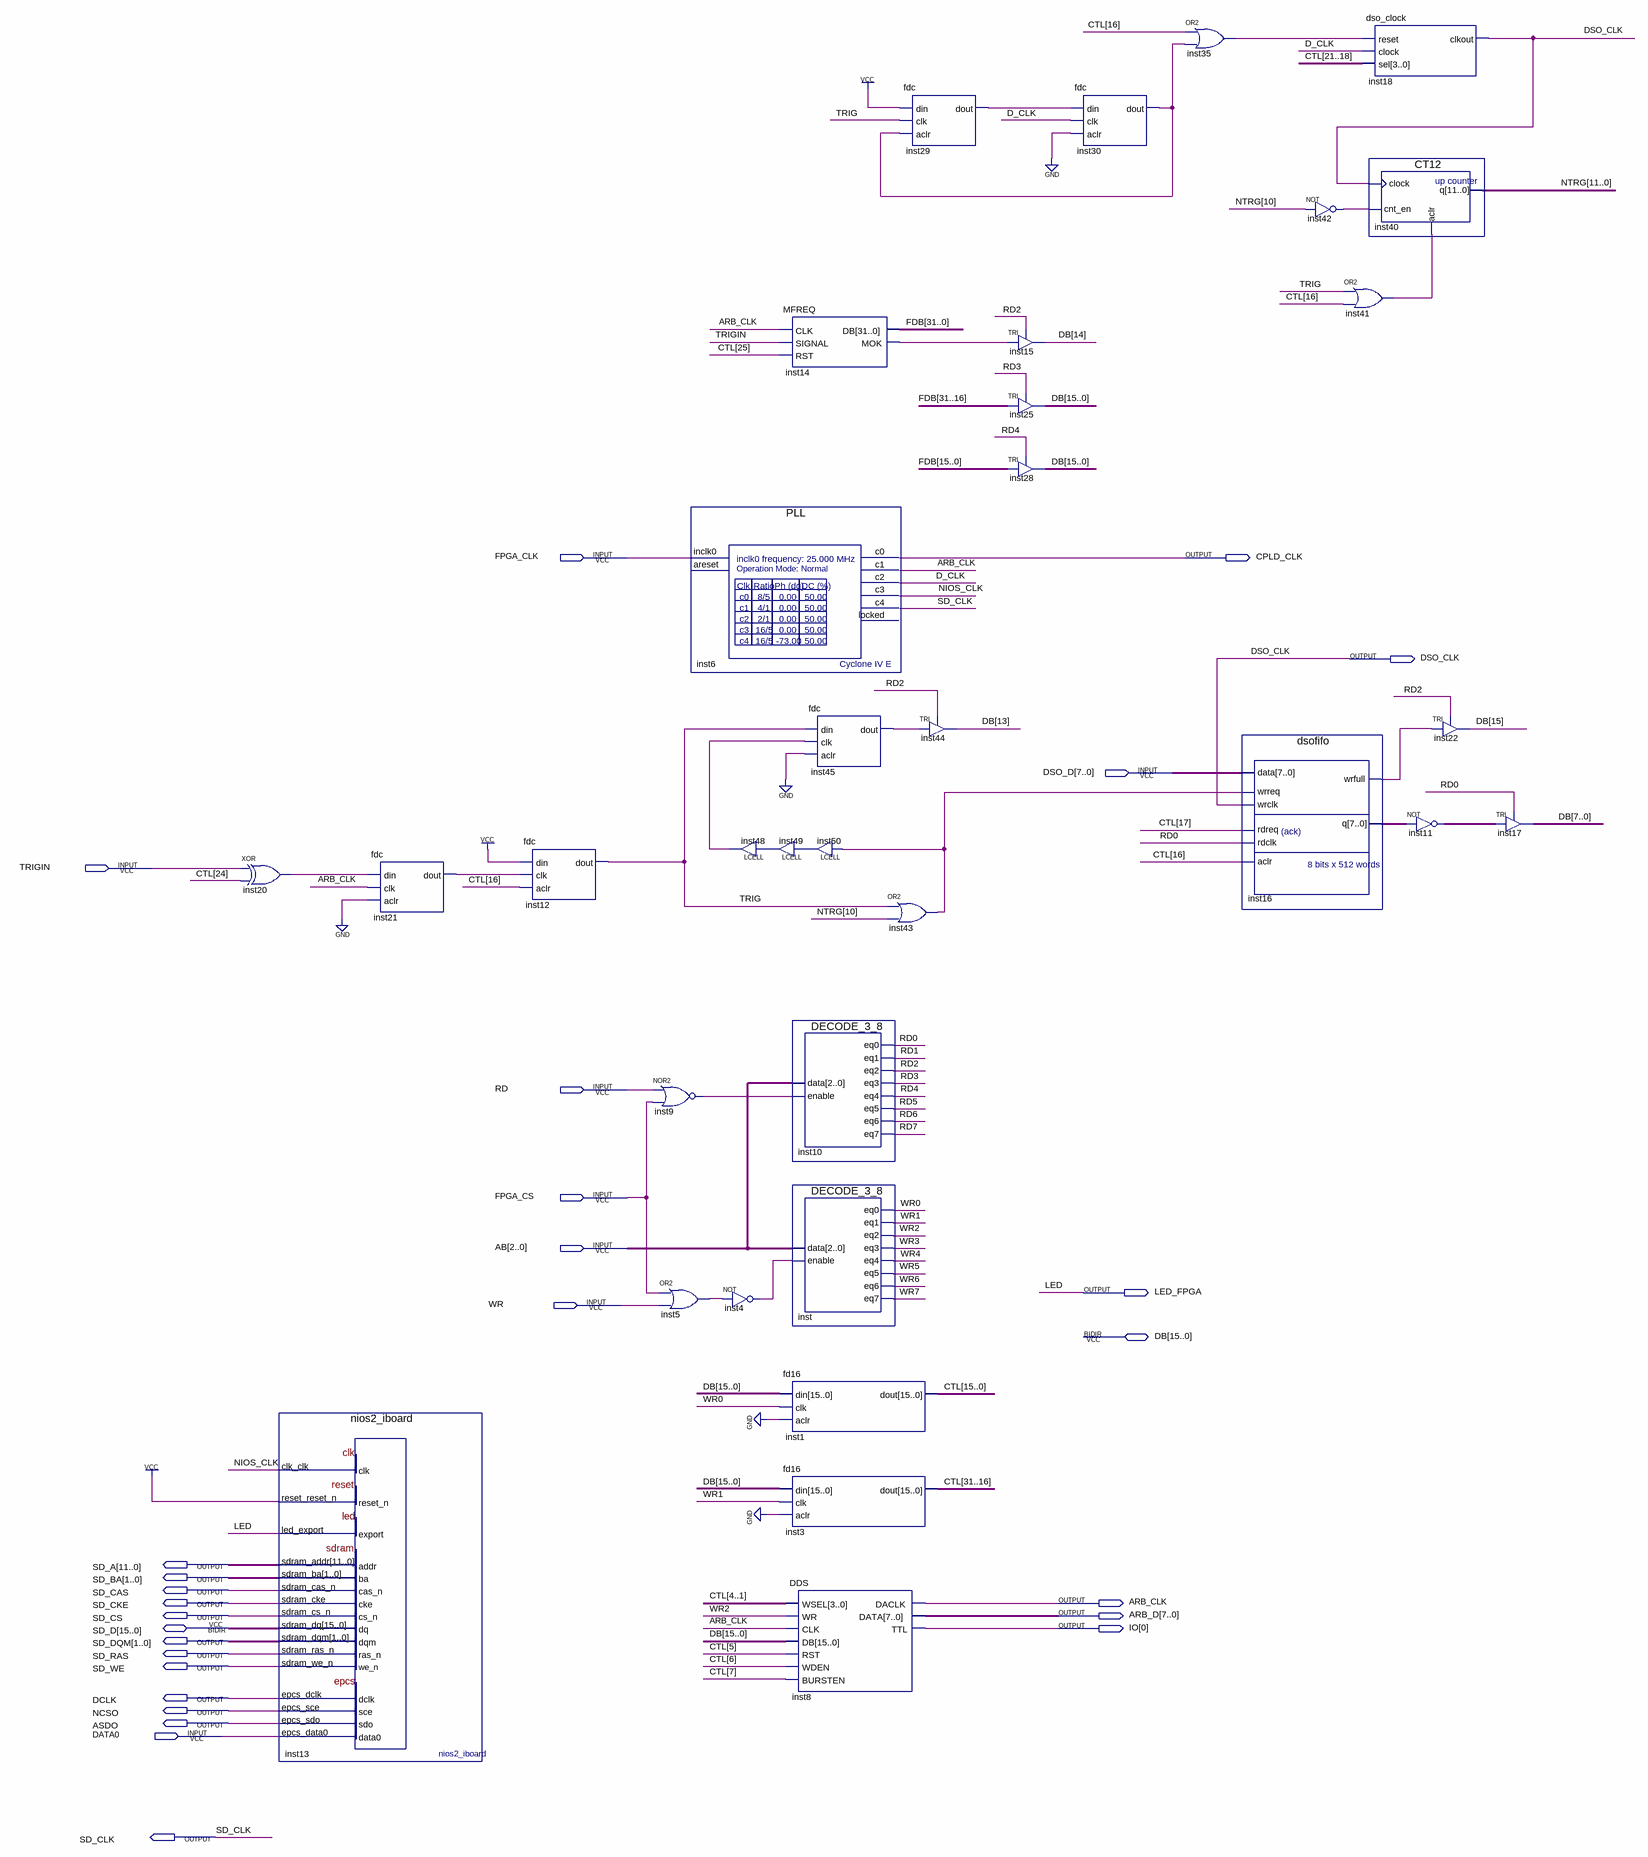
[diagram p0: schematic sheet]
// Quartus schematic DSO.bdf as structural Verilog: 34 symbols, 28 pins
module DSO (
  input  FPGA_CLK,
  input  [7:0] DSO_D,
  input  TRIGIN,
  input  RD,
  input  FPGA_CS,
  input  [2:0] AB,
  input  WR,
  input  DATA0,
  inout  [15:0] DB,
  inout  [15:0] SD_D,
  output CPLD_CLK,
  output DSO_CLK,
  output LED_FPGA,
  output [11:0] SD_A,
  output [1:0] SD_BA,
  output SD_CAS,
  output SD_CKE,
  output ARB_CLK,
  output SD_CS,
  output [7:0] ARB_D,
  output [0:0] IO,
  output [1:0] SD_DQM,
  output SD_RAS,
  output SD_WE,
  output DCLK,
  output NCSO,
  output ASDO,
  output SD_CLK
);

  wire D_CLK, inst4_out, inst5_out, inst9_out, inst14_mok, inst16_wrfull, inst20_out, inst21_dout,
       inst29_dout, inst30_dout, inst35_out, inst41_out, inst42_out, inst43_out, inst45_dout, inst48_out,
       inst49_out, inst50_out, NIOS_CLK, RD0, RD1, RD2, RD3, RD4, RD5, RD6, RD7, TRIG, WR0, WR1, WR2, WR3,
       WR4, WR5, WR6, WR7;
  wire [7:0] inst11_out, inst16_q;
  wire [11:0] NTRG;
  wire [31:0] CTL, FDB;

  xor inst20 (inst20_out, TRIGIN, CTL[24]);
  nios2_iboard inst13 (
    .clk_clk(NIOS_CLK), .reset_reset_n(1'b1), .epcs_data0(DATA0), .led_export(LED_FPGA), .sdram_addr(SD_A),
    .sdram_ba(SD_BA), .sdram_cas_n(SD_CAS), .sdram_cke(SD_CKE), .sdram_cs_n(SD_CS), .sdram_dqm(SD_DQM),
    .sdram_ras_n(SD_RAS), .sdram_we_n(SD_WE), .epcs_dclk(DCLK), .epcs_sce(NCSO), .epcs_sdo(ASDO),
    .sdram_dq(SD_D));
  fdc inst21 (.din(inst20_out), .clk(ARB_CLK), .aclr(1'b0), .dout(inst21_dout));
  fdc inst12 (.din(1'b1), .clk(inst21_dout), .aclr(CTL[16]), .dout(TRIG));
  nor inst9 (inst9_out, RD, FPGA_CS);
  PLL inst6 (
    .inclk0(FPGA_CLK), .c0(CPLD_CLK), .c1(ARB_CLK), .c2(D_CLK), .c3(NIOS_CLK), .c4(SD_CLK));  // open: areset, locked
  or inst5 (inst5_out, FPGA_CS, WR);
  LCELL inst48 (.IN(inst49_out), .OUT(inst48_out));
  not inst4 (inst4_out, inst5_out);
  MFREQ inst14 (.CLK(ARB_CLK), .SIGNAL(TRIGIN), .RST(CTL[25]), .DB(FDB), .MOK(inst14_mok));
  fdc inst45 (.din(TRIG), .clk(inst48_out), .aclr(1'b0), .dout(inst45_dout));
  LCELL inst49 (.IN(inst50_out), .OUT(inst49_out));
  LCELL inst50 (.IN(inst43_out), .OUT(inst50_out));
  DECODE_3_8 inst10 (
    .data(AB), .enable(inst9_out), .eq0(RD0), .eq1(RD1), .eq2(RD2), .eq3(RD3), .eq4(RD4), .eq5(RD5),
    .eq6(RD6), .eq7(RD7));
  DECODE_3_8 inst (
    .data(AB), .enable(inst4_out), .eq0(WR0), .eq1(WR1), .eq2(WR2), .eq3(WR3), .eq4(WR4), .eq5(WR5),
    .eq6(WR6), .eq7(WR7));
  fd16 inst1 (.din(DB), .clk(WR0), .aclr(1'b0), .dout(CTL[15:0]));
  fd16 inst3 (.din(DB), .clk(WR1), .aclr(1'b0), .dout(CTL[31:16]));
  DDS inst8 (
    .WSEL(CTL[4:1]), .WR(WR2), .CLK(ARB_CLK), .DB(DB), .RST(CTL[5]), .WDEN(CTL[6]), .BURSTEN(CTL[7]),
    .DACLK(ARB_CLK), .DATA(ARB_D), .TTL(IO[0]));
  fdc inst29 (.din(1'b1), .clk(TRIG), .aclr(inst30_dout), .dout(inst29_dout));
  or inst43 (inst43_out, TRIG, NTRG[10]);
  TRI inst44 (.IN(inst45_dout), .OE(RD2), .OUT(DB[13]));
  TRI inst15 (.IN(inst14_mok), .OE(RD2), .OUT(DB[14]));
  TRI inst25[15:0] (.IN(FDB[31:16]), .OE(RD3), .OUT(DB));
  TRI inst28[15:0] (.IN(FDB[15:0]), .OE(RD4), .OUT(DB));
  fdc inst30 (.din(inst29_dout), .clk(D_CLK), .aclr(1'b0), .dout(inst30_dout));
  or inst35 (inst35_out, CTL[16], inst30_dout);
  dsofifo inst16 (
    .data(DSO_D), .wrreq(inst43_out), .wrclk(DSO_CLK), .rdreq(CTL[17]), .rdclk(RD0), .aclr(CTL[16]),
    .wrfull(inst16_wrfull), .q(inst16_q));
  not inst42 (inst42_out, NTRG[10]);
  dso_clock inst18 (.reset(inst35_out), .clock(D_CLK), .sel(CTL[21:18]), .clkout(DSO_CLK));
  or inst41 (inst41_out, TRIG, CTL[16]);
  CT12 inst40 (.clock(DSO_CLK), .cnt_en(inst42_out), .aclr(inst41_out), .q(NTRG));
  assign inst11_out = ~inst16_q;  // NOT inst11, 8 bits wide
  TRI inst22 (.IN(inst16_wrfull), .OE(RD2), .OUT(DB[15]));
  TRI inst17[7:0] (.IN(inst11_out), .OE(RD0), .OUT(DB[7:0]));

  // Other names for the same wires on the sheet: LED = LED_FPGA
endmodule
